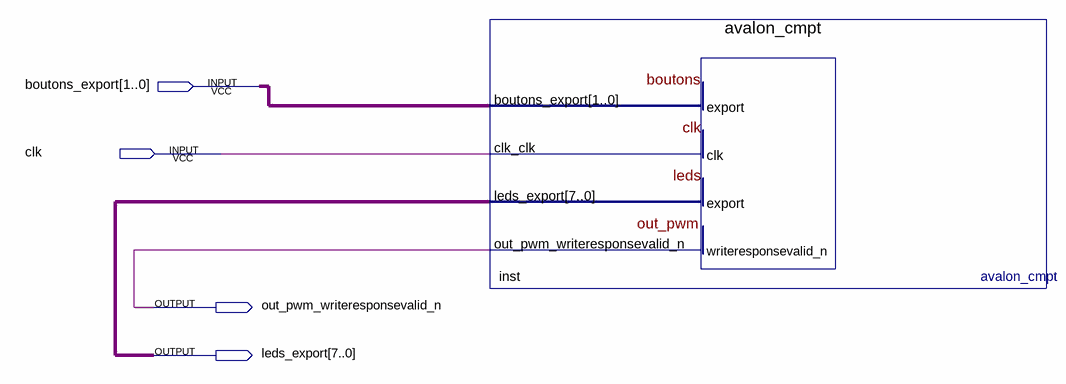
[diagram p0: schematic sheet]
// Quartus schematic avalon_pwm_schema.bdf as structural Verilog: 1 symbols, 4 pins
module avalon_pwm_schema (
  input  [1:0] boutons_export,
  input  clk,
  output out_pwm_writeresponsevalid_n,
  output [7:0] leds_export
);

  avalon_cmpt inst (
    .boutons_export(boutons_export), .clk_clk(clk), .leds_export(leds_export),
    .out_pwm_writeresponsevalid_n(out_pwm_writeresponsevalid_n));
endmodule
